# Altium schematic sheet IMTM-SCH01.SchDoc
size A
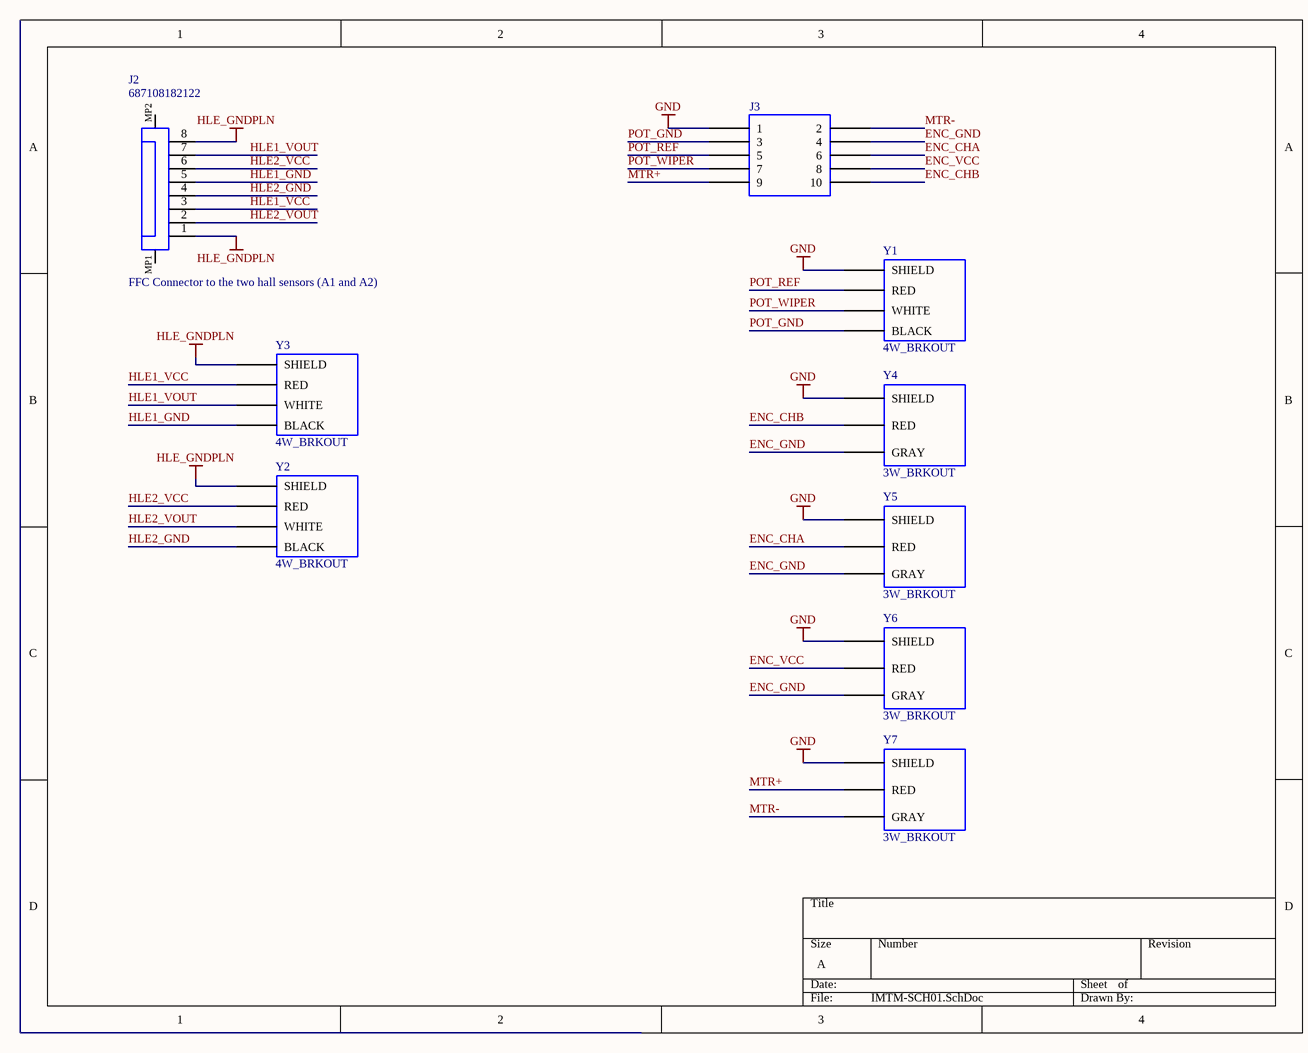
[diagram p0: IMTM-SCH01.SchDoc]

## Parts
J2  687108182122  [PCBComponent_1]
J3  B10B-PHDSS(LF)(SN)(P)  [B10B-PHDSS(LF)(SN)(P)]  (value not drawn)
Y1  4W_BRKOUT  [4W_BRKOUT]
Y2  4W_BRKOUT  [4W_BRKOUT]
Y3  4W_BRKOUT  [4W_BRKOUT]
Y4  3W_BRKOUT  [3W_BRKOUT]
Y5  3W_BRKOUT  [3W_BRKOUT]
Y6  3W_BRKOUT  [3W_BRKOUT]
Y7  3W_BRKOUT  [3W_BRKOUT]

## Nets
GND: J3.1 Y1.1(SHIELD) Y4.1(SHIELD) Y5.1(SHIELD) Y6.1(SHIELD) Y7.1(SHIELD)
HLE_GNDPLN: J2.1 J2.8 Y2.1(SHIELD) Y3.1(SHIELD)
ENC_CHA: J3.6 Y5.2(RED)
ENC_CHB: J3.10 Y4.2(RED)
ENC_GND: J3.4 Y4.3(GRAY) Y5.3(GRAY) Y6.3(GRAY)
ENC_VCC: J3.8 Y6.2(RED)
HLE1_GND: J2.5 Y3.4(BLACK)
HLE1_VCC: J2.3 Y3.2(RED)
HLE1_VOUT: J2.7 Y3.3(WHITE)
HLE2_GND: J2.4 Y2.4(BLACK)
HLE2_VCC: J2.6 Y2.2(RED)
HLE2_VOUT: J2.2 Y2.3(WHITE)
MTR+: J3.9 Y7.2(RED)
MTR-: J3.2 Y7.3(GRAY)
POT_GND: J3.3 Y1.4(BLACK)
POT_REF: J3.5 Y1.2(RED)
POT_WIPER: J3.7 Y1.3(WHITE)

Not connected (* = marked no-connect by the designer): J2 MP1 MP2

## Notes on the sheet
- (near J2) FFC Connector to the two hall sensors (A1 and A2)

## Library data of the parts
J2 = 687108182122: CONN FFC FPC 8POS 0.5MM R/A; Manufacturer: Wurth Electronics; Actuator Material: Nylon,Polyamide; Number of Positions: 8; Voltage Rating: 50V; Current Rating: 500mA; Pitch: 0.02inch; Supplier 1: Digi-Key; Manufacturer Part Number: 687108182122; RoHS: Yes; Category: FFC / FPC; Stock 1: 1416; Pricing 1: 1=1.41000, 100=1.17880, 500=1.03730, 1000=0.84870 (USD); Mount: Surface Mount; Contact Material: Bronze; Contact Plating: Tin; Housing Material: Polymer; Min Operating Temperature: -40°C; Max Operating Temperature: 105°C; Packaging: Tape and Reel; Termination: Solder; Flammability Rating: UL94 V-0; ComponentLink1URL: https://media.digikey.com/pdf/Data%20Sheets/Wurth%20Electronics%20PDFs/WR-FPC_FFC_Flyer.pdf?src-supplier=Digi-Key; ComponentLink1Description: https://media.digikey.com/pdf/Data%20Sheets/Wurth%20Electronics%20PDFs/WR-FPC_FFC_Flyer.pdf?src-supplier=Digi-Key; Supplier Part Number 1: 732-10016-1-ND
J3 = B10B-PHDSS(LF)(SN)(P): JST (JAPAN SOLDERLESS TERMINALS) - B10B-PHDSS(LF)(SN)(P) - CONNECTOR, HEADER, 10POS, 2MM, 2ROW; Number of Positions: 10; Gender: Male; Current Rating: 3A; Connector Type: Male Pin; Voltage Rating: 250V; Pitch: 0.079inch; Supplier 1: RSComponents; Manufacturer: JST; Manufacturer Part Number: B10B-PHDSS(LF)(SN)(P); RoHS: Yes; Category: Connectors; Stock 1: 35; Pricing 1: 5=0.54600, 125=0.40900, 500=0.37700, 2500=0.36900, 5000=0.36200 (USD); Mount: Through Hole; Color: Natural; Contact Material: Copper Alloy,Copper; Contact Plating: Tin; Orientation: Straight; Termination: Solder; Number of Contacts: 10; Number of Rows: 2; Packaging: Bulk; Package Quantity: 500; Row Spacing: 0.079inch; REACH SVHC: Unknown; ComponentLink1URL: https://datasheet.ciiva.com/11754/0900766b80ddecc5-11754210.pdf?src-supplier=RSComponents; ComponentLink1Description: https://datasheet.ciiva.com/11754/0900766b80ddecc5-11754210.pdf?src-supplier=RSComponents; ComponentLink2URL: https://datasheet.ciiva.com/712/ephd-712656.pdf?src-supplier=Digi-Key; ComponentLink2Description: https://datasheet.ciiva.com/712/ephd-712656.pdf?src-supplier=Digi-Key; ComponentLink3URL: https://datasheet.ciiva.com/46409/1699380-46409223.pdf?src-supplier=Element14; ComponentLink3Description: https://datasheet.ciiva.com/46409/1699380-46409223.pdf?src-supplier=Element14; Supplier Part Number 1: 6881379